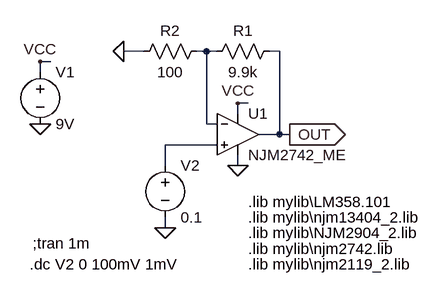
[diagram p0: schematic Single_Supply_NonInV_Amp.asc]
Single_Supply_NonInV_Amp.asc, the LTspice schematic file:
Version 4
SHEET 1 880 680
WIRE 160 48 128 48
WIRE 256 48 240 48
WIRE 272 48 256 48
WIRE 368 48 352 48
WIRE 16 64 0 64
WIRE 0 80 0 64
WIRE 320 128 304 128
WIRE 304 144 304 128
WIRE 256 160 256 48
WIRE 272 160 256 160
WIRE 368 176 368 48
WIRE 368 176 336 176
WIRE 384 176 368 176
WIRE 272 192 192 192
WIRE 192 224 192 192
WIRE 304 224 304 208
WIRE 192 320 192 304
FLAG 0 160 0
FLAG 0 64 VCC
FLAG 304 224 0
FLAG 304 128 VCC
FLAG 192 320 0
FLAG 128 48 0
FLAG 384 176 OUT
IOPIN 384 176 Out
SYMBOL voltage 0 64 R0
WINDOW 123 0 0 Left 2
WINDOW 39 0 0 Left 2
SYMATTR InstName V1
SYMATTR Value 9V
SYMBOL voltage 192 208 R0
WINDOW 123 0 0 Left 2
WINDOW 39 0 0 Left 2
SYMATTR InstName V2
SYMATTR Value 0.1
SYMBOL res 368 32 R90
WINDOW 0 0 56 VBottom 2
WINDOW 3 32 56 VTop 2
SYMATTR InstName R1
SYMATTR Value 9.9k
SYMBOL res 256 32 R90
WINDOW 0 0 56 VBottom 2
WINDOW 3 32 56 VTop 2
SYMATTR InstName R2
SYMATTR Value 100
SYMBOL Opamps\\opamp2 304 112 R0
SYMATTR InstName U1
SYMATTR Value NJM2742_ME
TEXT -12 344 Left 2 !;tran 1m
TEXT -16 376 Left 2 !.dc V2 0 100mV 1mV
TEXT 320 304 Left 2 !.lib mylib\\njm13404_2.lib
TEXT 320 280 Left 2 !.lib mylib\\LM358.101
TEXT 320 328 Left 2 !.lib mylib\\NJM2904_2.lib
TEXT 320 352 Left 2 !.lib mylib\\njm2742.lib
TEXT 320 376 Left 2 !.lib mylib\\njm2119_2.lib

The netlist it stands for:
* Single_Supply_NonInV_Amp.asc
V1 VCC 0 9V
V2 N002 0 0.1
R1 OUT N001 9.9k
R2 N001 0 100
XU1 N002 N001 VCC 0 OUT NJM2742_ME  ; pins In+ In- V+ V- OUT
;tran 1m
.dc V2 0 100mV 1mV
.lib mylib\njm13404_2.lib
.lib mylib\LM358.101
.lib mylib\NJM2904_2.lib
.lib mylib\njm2742.lib
.lib mylib\njm2119_2.lib
.backanno
.end